# EAGLE design DC24-Darknet_Badge (EAGLE 7.3.0)
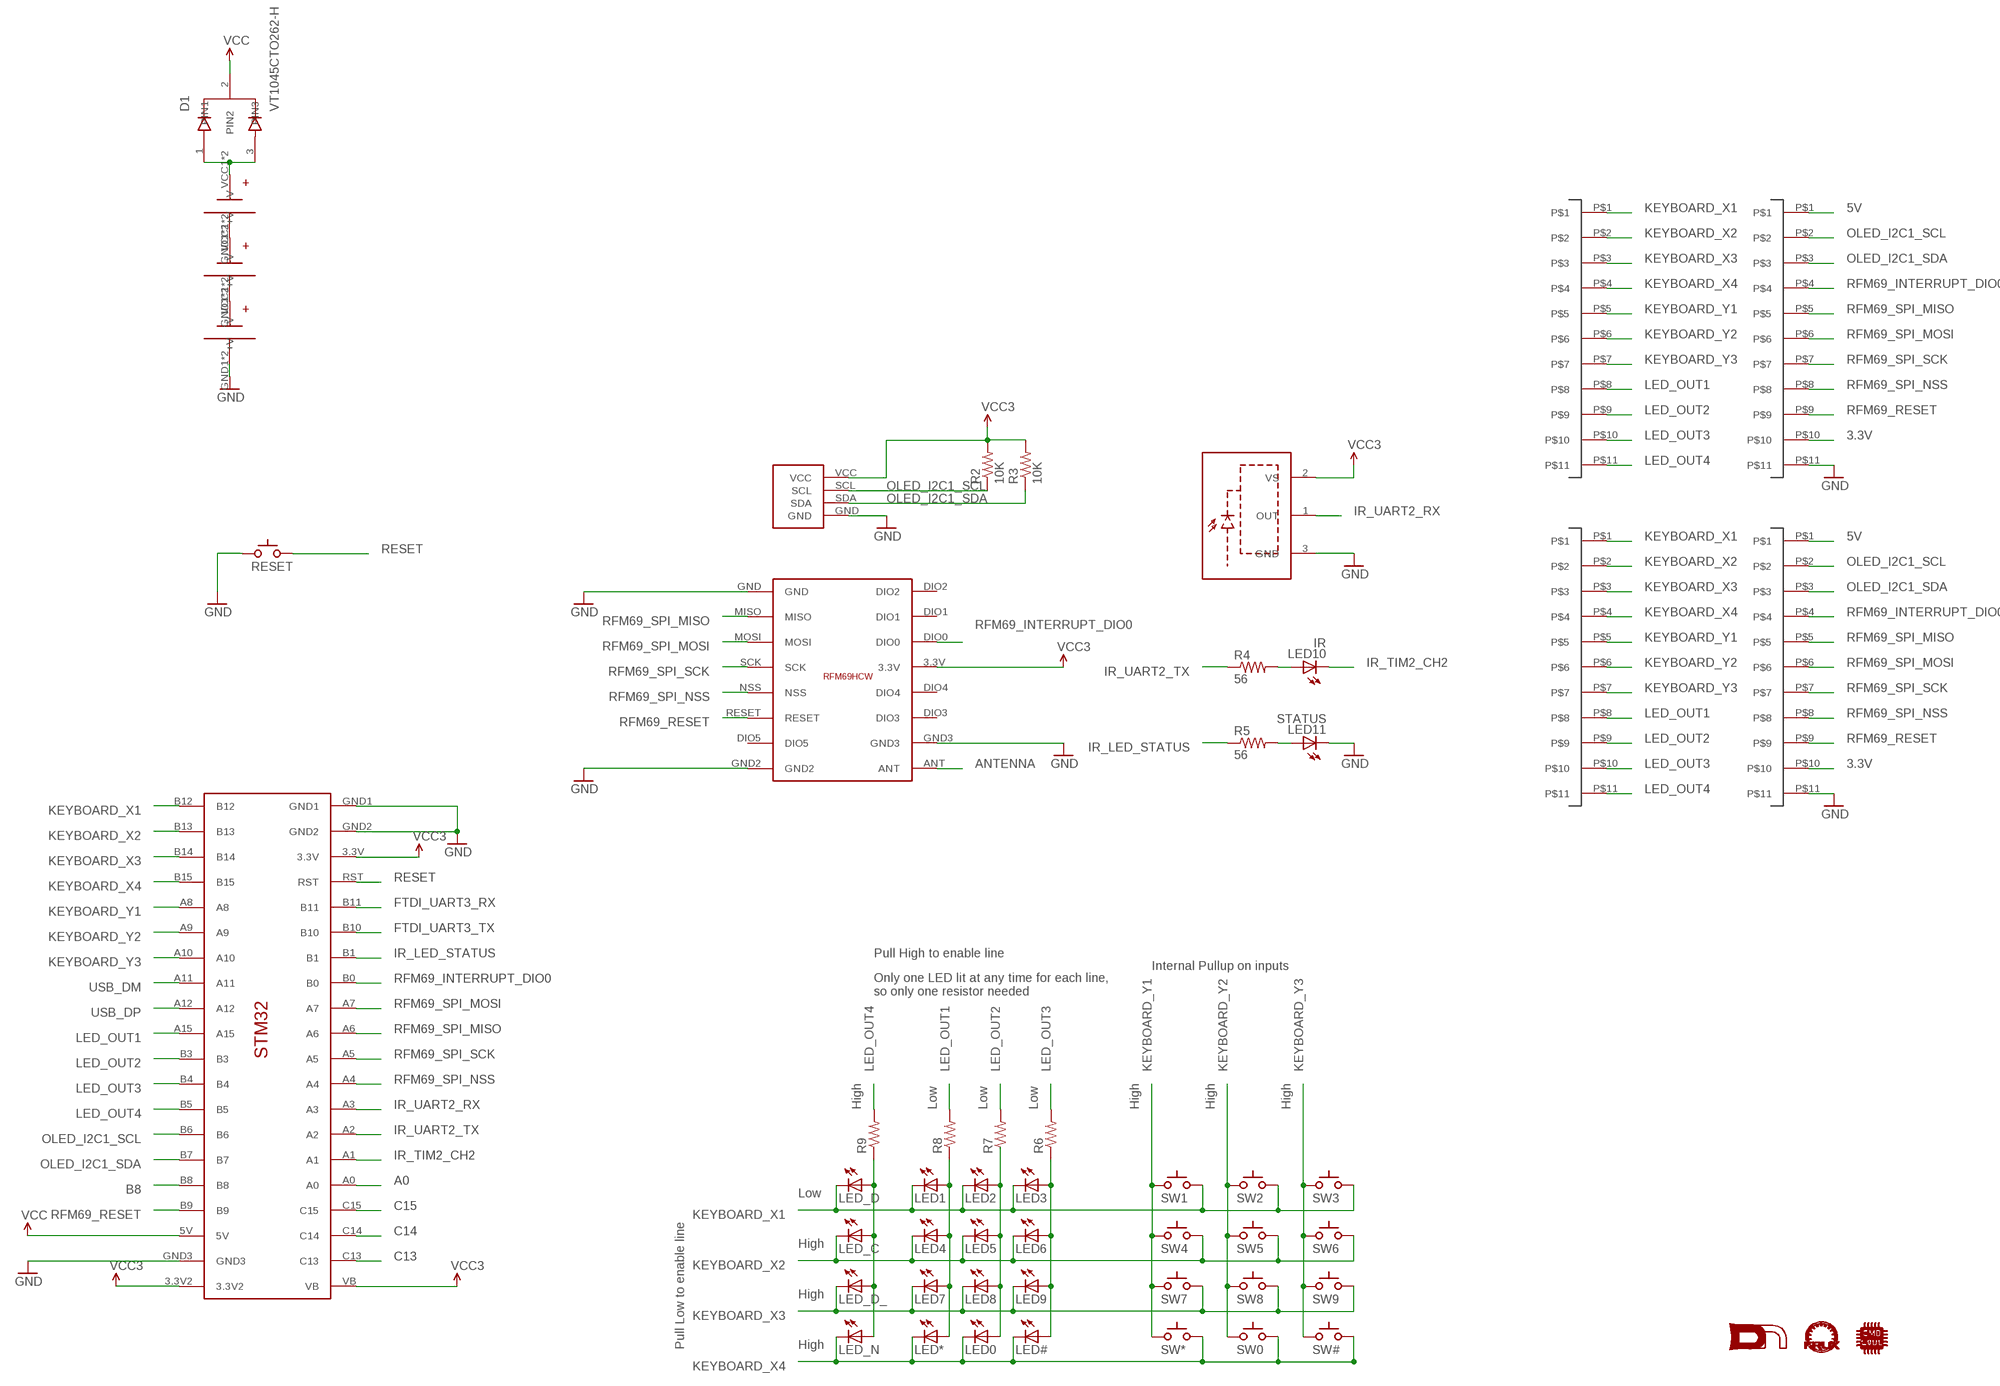
[diagram p0: schematic, sheet 1]

## Parts
D1  VT1045CTO262-H  [TO262-H]
LED0  LEDREVERSEMOUNT  [GULLWING_LED]
LED1  LEDREVERSEMOUNT  [GULLWING_LED]
LED2  LEDREVERSEMOUNT  [GULLWING_LED]
LED3  LEDREVERSEMOUNT  [GULLWING_LED]
LED4  LEDREVERSEMOUNT  [GULLWING_LED]
LED5  LEDREVERSEMOUNT  [GULLWING_LED]
LED6  LEDREVERSEMOUNT  [GULLWING_LED]
LED7  LEDREVERSEMOUNT  [GULLWING_LED]
LED8  LEDREVERSEMOUNT  [GULLWING_LED]
LED9  LEDREVERSEMOUNT  [GULLWING_LED]
LED10  IR  LEDLED5MM_EDGE  [LED5MM-EDGE]
LED11  STATUS  LEDLED5MM_EDGE  [LED5MM-EDGE]
LED#  LEDREVERSEMOUNT  [GULLWING_LED]
LED*  LEDREVERSEMOUNT  [GULLWING_LED]
LED_C  LEDREVERSEMOUNT  [GULLWING_LED]
LED_D  LEDREVERSEMOUNT  [GULLWING_LED]
LED_D_  LEDREVERSEMOUNT  [GULLWING_LED]
LED_N  LEDREVERSEMOUNT  [GULLWING_LED]
Q1  SOP22  [IR-MODULE]
R2  10K  RESISTORAXIAL-0.3  [AXIAL-0.3]
R3  10K  RESISTORAXIAL-0.3  [AXIAL-0.3]
R4  56  RESISTORAXIAL-0.3  [AXIAL-0.3]
R5  56  RESISTORAXIAL-0.3  [AXIAL-0.3]
R6  RESISTOR1206  [1206]
R7  RESISTOR1206  [1206]
R8  RESISTOR1206  [1206]
R9  RESISTOR1206  [1206]
RESET  SWITCH_TACTILETACTILE-2PIN-NARROW  [TACTILE-2PIN-NARROW]
SW0  SWITCH_TACTILETACTILE-2PIN-NARROW  [TACTILE-2PIN-NARROW]
SW1  SWITCH_TACTILETACTILE-2PIN-NARROW  [TACTILE-2PIN-NARROW]
SW2  SWITCH_TACTILETACTILE-2PIN-NARROW  [TACTILE-2PIN-NARROW]
SW3  SWITCH_TACTILETACTILE-2PIN-NARROW  [TACTILE-2PIN-NARROW]
SW4  SWITCH_TACTILETACTILE-2PIN-NARROW  [TACTILE-2PIN-NARROW]
SW5  SWITCH_TACTILETACTILE-2PIN-NARROW  [TACTILE-2PIN-NARROW]
SW6  SWITCH_TACTILETACTILE-2PIN-NARROW  [TACTILE-2PIN-NARROW]
SW7  SWITCH_TACTILETACTILE-2PIN-NARROW  [TACTILE-2PIN-NARROW]
SW8  SWITCH_TACTILETACTILE-2PIN-NARROW  [TACTILE-2PIN-NARROW]
SW9  SWITCH_TACTILETACTILE-2PIN-NARROW  [TACTILE-2PIN-NARROW]
SW#  SWITCH_TACTILETACTILE-2PIN-NARROW  [TACTILE-2PIN-NARROW]
SW*  SWITCH_TACTILETACTILE-2PIN-NARROW  [TACTILE-2PIN-NARROW]
U$1  I2C_0.96_OLEDOLED  [I2C_0.96_OLED]
U$2  RFM69HCWRFN69HCWSMD  [16PIN-PCB-SMD]
U$3  AAA_BATTERYAAA_BATTERY_CLIP  [AAA_BATTERY_CLIP]
U$4  AAA_BATTERYAAA_BATTERY_CLIP  [AAA_BATTERY_CLIP]
U$5  AAA_BATTERYAAA_BATTERY_CLIP  [AAA_BATTERY_CLIP]
U$6  HEADER_11PIN  [1X11]
U$13  HEADER_11PIN  [1X11]
U$14  HEADER_11PIN  [1X11]
U$15  STM32_DEV_BOARDSTM32_DEV_BOARD  [STM32_DEV_BOARD]
U$17  HEADER_11PIN  [1X11]
U$21  KRUX_LOGO  [KRUX_LOGO]
U$22  DN_LOGO  [DN_LOGO]
U$23  CMD_C0DE_LOGO  [CMD_C0DE_LOGO]

## Nets
3.3V: Q1.2(VS) R2.P$2 R3.P$2 U$1.VCC U$2.3.3V U$13.P$10 U$15.3.3V U$15.3.3V2 U$15.VB U$17.P$10 ; supply symbol labelled VCC3
5V: D1.2(PIN2) U$13.P$1 U$15.5V U$17.P$1 ; supply symbol labelled VCC
A0: U$15.A0
ANTENNA: U$2.ANT
B8: U$15.B8
C13: U$15.C13
C14: U$15.C14
C15: U$15.C15
FTDI_UART3_RX: U$15.B11
FTDI_UART3_TX: U$15.B10
GND: LED11.K(C) Q1.3(GND) RESET.P$2(C) U$1.GND U$2.GND U$2.GND2 U$2.GND3 U$5.GND1(-V) U$5.GND2(-V) U$13.P$11 U$15.GND1 U$15.GND2 U$15.GND3 U$17.P$11
IR_LED_STATUS: R5.P$1 U$15.B1
IR_TIM2_CH2: LED10.K(C) U$15.A1
IR_UART2_RX: Q1.1(OUT) U$15.A3
IR_UART2_TX: R4.P$1 U$15.A2
KEYBOARD_X1: LED1.C LED2.C LED3.C LED_D.C SW1.P$1(A) SW2.P$1(A) SW3.P$1(A) U$6.P$1 U$14.P$1 U$15.B12
KEYBOARD_X2: LED4.C LED5.C LED6.C LED_C.C SW4.P$1(A) SW5.P$1(A) SW6.P$1(A) U$6.P$2 U$14.P$2 U$15.B13
KEYBOARD_X3: LED7.C LED8.C LED9.C LED_D_.C SW7.P$1(A) SW8.P$1(A) SW9.P$1(A) U$6.P$3 U$14.P$3 U$15.B14
KEYBOARD_X4: LED0.C LED#.C LED*.C LED_N.C SW0.P$1(A) SW#.P$1(A) SW*.P$1(A) U$6.P$4 U$14.P$4 U$15.B15
KEYBOARD_Y1: SW1.P$2(C) SW4.P$2(C) SW7.P$2(C) SW*.P$2(C) U$6.P$5 U$14.P$5 U$15.A8
KEYBOARD_Y2: SW0.P$2(C) SW2.P$2(C) SW5.P$2(C) SW8.P$2(C) U$6.P$6 U$14.P$6 U$15.A9
KEYBOARD_Y3: SW3.P$2(C) SW6.P$2(C) SW9.P$2(C) SW#.P$2(C) U$6.P$7 U$14.P$7 U$15.A10
LED_OUT1: R8.2 U$6.P$8 U$14.P$8 U$15.A15
LED_OUT2: R7.2 U$6.P$9 U$14.P$9 U$15.B3
LED_OUT3: R6.2 U$6.P$10 U$14.P$10 U$15.B4
LED_OUT4: R9.2 U$6.P$11 U$14.P$11 U$15.B5
N$1: LED10.A R4.P$2
N$2: LED11.A R5.P$2
N$3: D1.1(PIN1) D1.3(PIN3) U$3.VCC1(+V) U$3.VCC2(+V)
N$8: LED3.A LED6.A LED9.A LED#.A R6.1
N$9: LED0.A LED2.A LED5.A LED8.A R7.1
N$10: LED1.A LED4.A LED7.A LED*.A R8.1
N$11: LED_C.A LED_D.A LED_D_.A LED_N.A R9.1
N$13: U$3.GND1(-V) U$3.GND2(-V) U$4.VCC1(+V) U$4.VCC2(+V)
N$14: U$4.GND1(-V) U$4.GND2(-V) U$5.VCC1(+V) U$5.VCC2(+V)
OLED_I2C1_SCL: R2.P$1 U$1.SCL U$13.P$2 U$15.B6 U$17.P$2
OLED_I2C1_SDA: R3.P$1 U$1.SDA U$13.P$3 U$15.B7 U$17.P$3
RESET: RESET.P$1(A) U$15.RST
RFM69_INTERRUPT_DIO0: U$2.DIO0 U$13.P$4 U$15.B0 U$17.P$4
RFM69_RESET: U$2.RESET U$13.P$9 U$15.B9 U$17.P$9
RFM69_SPI_MISO: U$2.MISO U$13.P$5 U$15.A6 U$17.P$5
RFM69_SPI_MOSI: U$2.MOSI U$13.P$6 U$15.A7 U$17.P$6
RFM69_SPI_NSS: U$2.NSS U$13.P$8 U$15.A4 U$17.P$8
RFM69_SPI_SCK: U$2.SCK U$13.P$7 U$15.A5 U$17.P$7
USB_DM: U$15.A11
USB_DP: U$15.A12
Unconnected: U$2.DIO1 U$2.DIO2 U$2.DIO3 U$2.DIO4 U$2.DIO5

## Notes on the sheet
- Pull High to enable line
- Internal Pullup on inputs
- Only one LED lit at any time for each line,
  so only one resistor needed
- High | Low | Low | Low | High | High | High
- Low
- High
- High
- Pull Low to enable line | High

## Library data of the parts
D1 = SYNShop:VT1045C
LED0 LED1-LED11 LED# LED* LED_C LED_D LED_D_ LED_N = SYNShop:LED: LEDs Standard schematic elements and footprints for 5mm, 3mm, 1206, and 0603 sized LEDs. 5mm - Spark Fun Electronics SKU : COM-00529 (and others)
Q1 = SYNShop:SOP22
R2-R9 = SYNShop:RESISTOR: Resistor Basic schematic elements and footprints for 0603, 1206, and PTH resistors.
RESET SW0 SW1-SW9 SW# SW* = SYNShop:SWITCH_TACTILE
U$1 = SYNShop:I2C_0.96_OLED
U$2 = SYNShop:RFM69HCW
U$3-U$5 = SYNShop:AAA_BATTERY
U$6 U$13 U$14 U$17 = SYNShop:HEADER_11PIN
U$15 = SYNShop:STM32_DEV_BOARD
U$21 = SYNShop:KRUX_LOGO
U$22 = SYNShop:DN_LOGO
U$23 = SYNShop:CMD_C0DE_LOGO

## Board
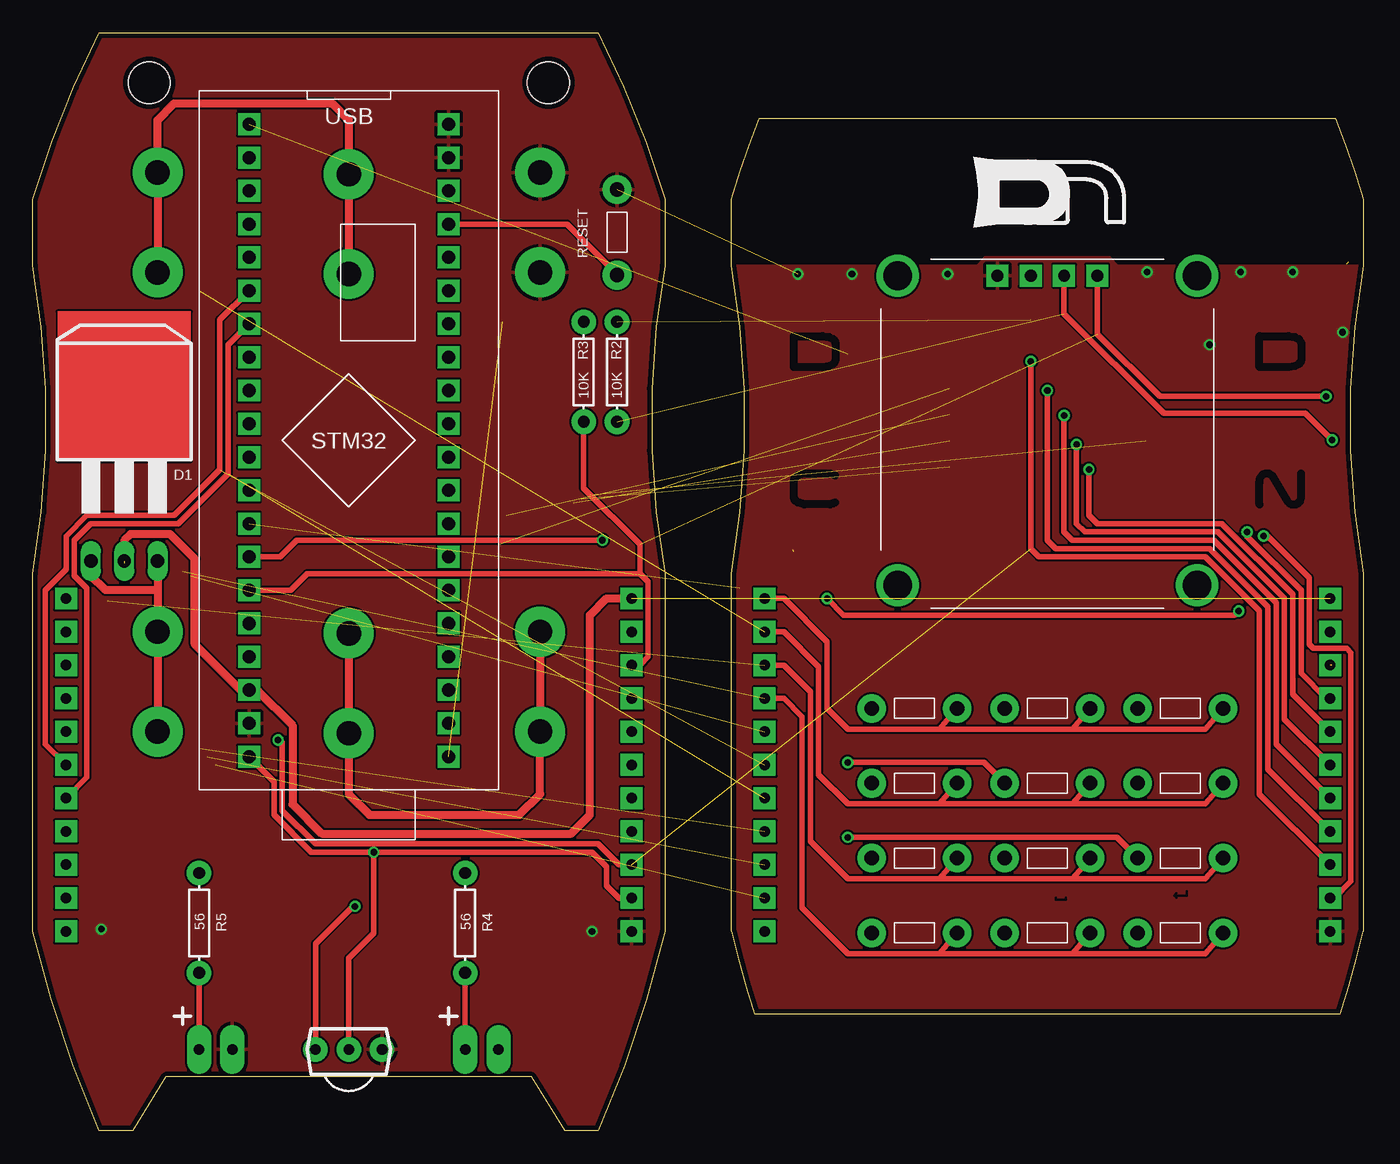
[diagram p1: board, top side]
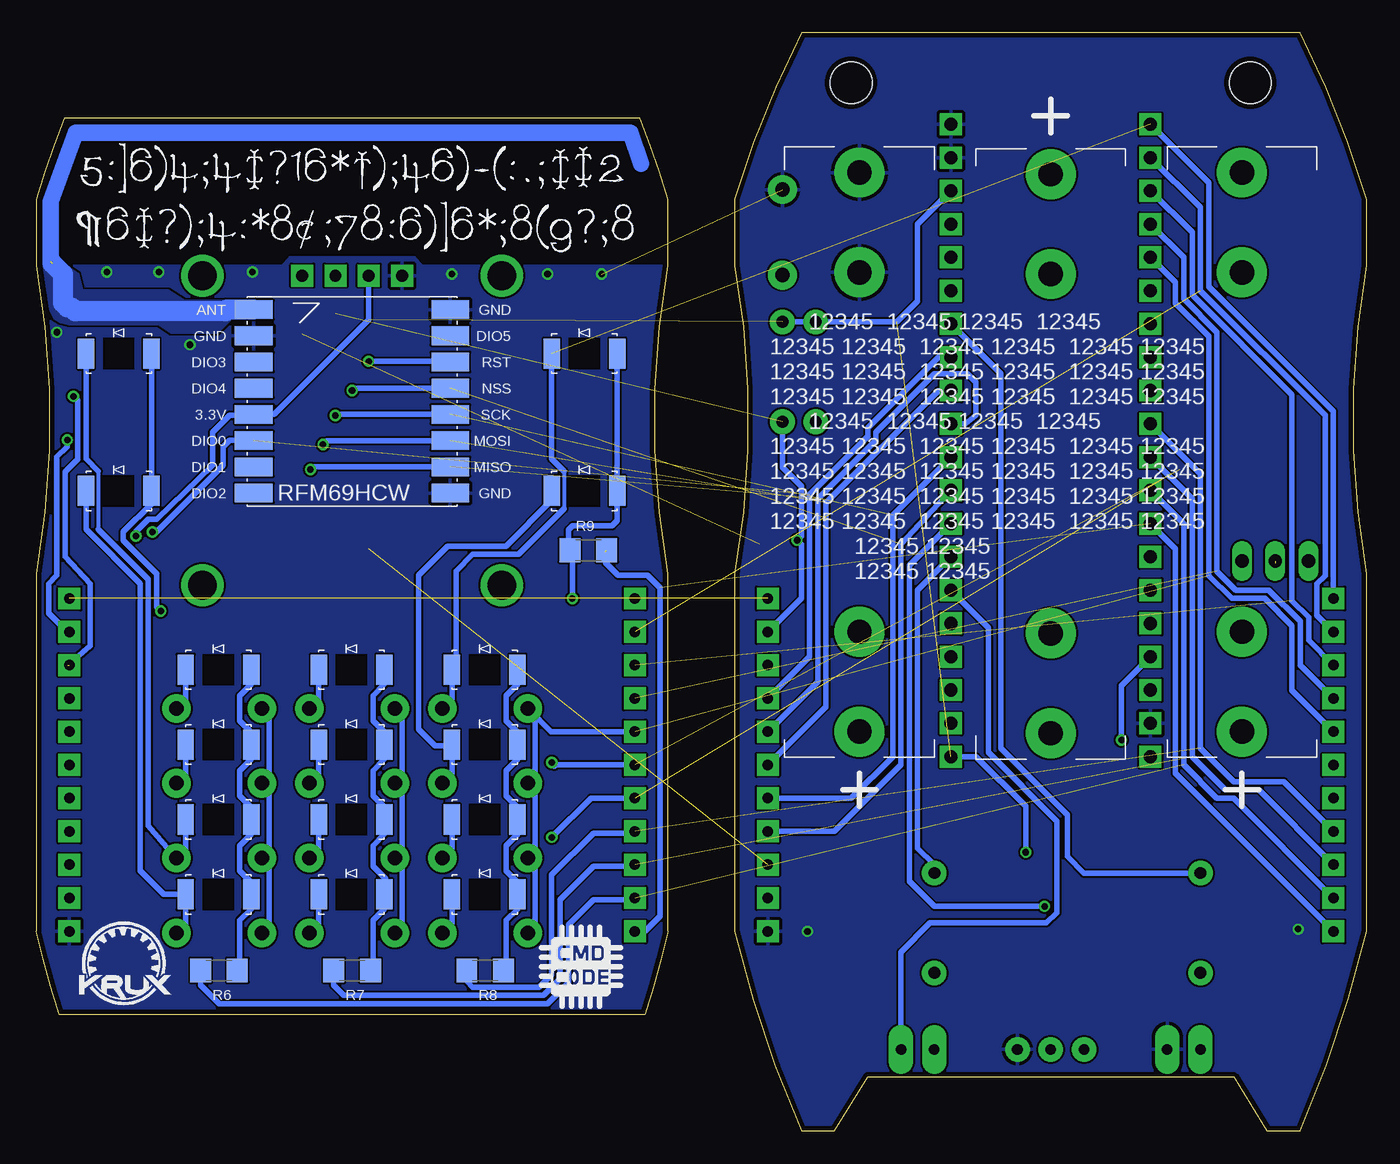
[diagram p2: board, bottom side, seen from below]

Size 101.6 x 83.82 mm. Coordinates in mm from the lower left corner, seen from the top.
Outline: 0,71.12 arc-10 5.08,83.82 43.18,83.82 arc-10 48.26,71.12 48.26,66.04 arc20 48.26,42.55 48.26,15.24 arc-10 43.18,0 40.64,0 38.1,4.13 10.16,4.13 7.62,0 5.08,0 arc-10 0,15.24 0,42.55 arc20 0,66.04 0,71.12
Outline: 55.5,77.31 99.44,77.31 arc-5 101.6,71.12 101.6,66.04 arc20 101.6,42.55 101.6,15.24 arc-4 99.84,8.91 55.11,8.89 arc-4 53.34,15.24 53.34,42.55 arc20 53.34,66.04 53.34,71.12 arc-5 55.5,77.31
Copper layers (1*16): Top 0.0356mm / dielectric 1.5011mm / Bottom 0.0356mm
Design rules "LaenPCBOrder": minimum track width 6mil, minimum drill 13mil, track to track 6mil, track to pad 6mil, pad to pad 6mil, via to via 6mil, smd to smd 6mil, copper to edge 15mil, drill to drill 6mil, minimum pad ring 7mil, minimum via ring 7mil, stop-mask expansion 4mil, vias tented up to drill 0mil, thermal gap 10mil
Holes 3.2 mm at 8.89,80.01 39.37,80.01
tRestrict: 55 lines

### Footprints (pad centres in the part's own frame; a part is rotated, then mirrored left to right if it is on the bottom)
TO262-H = drill 1.016 long: 1 -2.54,-12.7; 2 0,-12.7; 3 2.54,-12.7
GULLWING_LED = smd 1.245 x 2.3: A 5,-1.5; C 0,-1.5
LED5MM-EDGE = drill 0.813 pad 1.88 long: A -1.27,0; K 1.27,0
IR-MODULE = drill 0.813 pad 1.88: 1 -2.54,0; 2 0,0; 3 2.54,0
AXIAL-0.3 = drill 0.9 pad 1.88: P$1 -3.81,0; P$2 3.81,0
1206 = smd 1.6 x 1.8: 1 -1.4,0; 2 1.4,0
TACTILE-2PIN-NARROW = drill 1.1 pad 2.184: P$1 3.264,0; P$2 -3.264,0
I2C_0.96_OLED = drill 0.9 pad 1.676 square: GND -3.81,0; SCL 1.27,0; SDA 3.81,0; VCC -1.27,0 | drill 2.2: P$5 11.43,0; P$6 -11.43,0; P$7 11.43,-23.622; P$8 -11.43,-23.622
16PIN-PCB-SMD = smd 2.9 x 1.422: 3.3V 7.5,1; ANT 7.5,-7; DIO0 7.5,3; DIO1 7.5,5; DIO2 7.5,7; DIO3 7.5,-3; DIO4 7.5,-1; DIO5 -7.5,-5; GND -7.5,7; GND2 -7.5,-7; GND3 7.5,-5; MISO -7.5,5; MOSI -7.5,3; NSS -7.5,-1; RESET -7.5,-3; SCK -7.5,1
AAA_BATTERY_CLIP = drill 1.854 pad 3.81: GND1 35.052,0; GND2 42.672,0; VCC1 0,0; VCC2 7.62,0
1X11 = drill 0.8 pad 1.676 square: P$1 0,0; P$2 0,-2.54; P$3 0,-5.08; P$4 0,-7.62; P$5 0,-10.16; P$6 0,-12.7; P$7 0,-15.24; P$8 0,-17.78; P$9 0,-20.32; P$10 0,-22.86; P$11 0,-25.4
STM32_DEV_BOARD = drill 1 pad 1.676 square: 3.3V 15.24,-5.08; 3.3V2 0,-48.26; 5V 0,-43.18; A0 15.24,-38.1; A1 15.24,-35.56; A2 15.24,-33.02; A3 15.24,-30.48; A4 15.24,-27.94; A5 15.24,-25.4; A6 15.24,-22.86; A7 15.24,-20.32; A8 0,-10.16; A9 0,-12.7; A10 0,-15.24; A11 0,-17.78; A12 0,-20.32; A15 0,-22.86; B0 15.24,-17.78; B1 15.24,-15.24; B3 0,-25.4; B4 0,-27.94; B5 0,-30.48; B6 0,-33.02; B7 0,-35.56; B8 0,-38.1; B9 0,-40.64; B10 15.24,-12.7; B11 15.24,-10.16; B12 0,0; B13 0,-2.54; B14 0,-5.08; B15 0,-7.62; C13 15.24,-45.72; C14 15.24,-43.18; C15 15.24,-40.64; GND1 15.24,0; GND2 15.24,-2.54; GND3 0,-45.72; RST 15.24,-7.62; VB 15.24,-48.26

### Placement (x,y rotation side)
D1  6.99,56.2 0 top
LED0  80.01,19.56 0 bottom
LED1  69.85,36.7 0 bottom
LED2  80.01,36.7 0 bottom
LED3  90.17,36.7 0 bottom
LED4  69.85,30.99 0 bottom
LED5  80.01,30.99 0 bottom
LED6  90.17,30.99 0 bottom
LED7  69.85,25.27 0 bottom
LED8  80.01,25.27 0 bottom
LED9  90.17,25.27 0 bottom
LED10  34.29,6.22 0 top
LED11  13.97,6.22 0 top
LED#  90.17,19.56 0 bottom
LED*  69.85,19.56 0 bottom
LED_C  62.23,50.36 0 bottom
LED_D  62.23,60.83 0 bottom
LED_D_  97.79,60.83 0 bottom
LED_N  97.79,50.36 0 bottom
Q1  24.13,6.22 0 top
R2  44.61,57.94 90 top
R3  42.07,57.94 90 top
R4  33.02,15.87 270 top
R5  12.7,15.87 270 top
R6  87.63,12.26 180 bottom
R7  77.47,12.26 180 bottom
R8  67.31,12.26 180 bottom
R9  59.44,44.32 0 bottom
RESET  44.61,68.58 270 top
SW0  77.47,15.11 0 top
SW1  67.31,32.26 0 top
SW2  77.47,32.26 0 top
SW3  87.63,32.26 0 top
SW4  67.31,26.54 0 top
SW5  77.47,26.54 0 top
SW6  87.63,26.54 0 top
SW7  67.31,20.83 0 top
SW8  77.47,20.83 0 top
SW9  87.63,20.83 0 top
SW#  87.63,15.11 0 top
SW*  67.31,15.11 0 top
U$1  77.47,65.28 0 top
U$2  77.47,55.69 180 bottom
U$3  9.52,30.48 90 bottom
U$4  24.13,73.03 270 bottom
U$5  38.73,30.48 90 bottom
U$6  55.88,40.64 0 top
U$13  99.06,40.64 0 top
U$14  2.54,40.64 0 top
U$15  16.51,76.84 0 top
U$17  45.72,40.64 0 top
U$21  94.93,12.86 0 bottom
U$22  71.44,69.06 0 top
U$23  60.01,12.86 0 bottom

### Tracks (layer width: path | path; a pad name or v marks a point on that pad's centre or on a via)
3.3V  (via drill 0.5)  (2 unrouted)
  Top 0.406: U$15.3.3V2 18.41,26.67 18.41,24.13 21.27,21.27 v26.04,21.27 | v26.04,21.27 42.7,21.27 43.81,20.16 43.81,18.73 44.77,17.78 U$17.P$10 | U$13.P$10 99.38,17.78 100.65,19.05 100.65,36.51 100.33,36.83 97.79,36.83 97.47,37.15 97.47,42.23 94.3,45.4 v93.98,45.4 | Q1.2 24.13,13.18 26.04,15.08 v26.04,21.27
  Bottom 0.406: U$15.VB 29.84,28.58 26.04,24.77 v26.04,21.27 | U$15.3.3V 34.29,69.22 34.29,63.34 35.88,61.75 R3.P$2 R2.P$2 | v93.98,45.4 93.98,45.72 93.03,46.67 92.39,46.67 88.11,50.8 88.11,53.34 86.84,54.61 85.05,54.61 U$2.3.3V 83.42,54.69 76.2,61.91 U$1.VCC
5V  (2 unrouted)
  Top 0.61: U$17.P$1 43.81,40.64 42.55,39.37 42.55,24.13 41.12,22.7 22.07,22.7 19.84,24.92 19.84,30.96 17.14,33.66 U$15.5V 15.88,33.66 12.38,37.15 12.38,43.66 10.48,45.56 7.46,45.56 6.99,45.09 6.99,43.34
ANTENNA  (1 unrouted)
  Bottom 1.27: 100.49,66.36 100.49,70.96 98.58,76.2 56.2,76.2 55.4,73.82
  Bottom 1.524: U$2.ANT 87.01,62.69 87.15,62.55 98.58,62.55 98.9,62.86 99.22,62.86 99.54,63.18 99.54,65.41 100.33,66.2
  pour Bottom: 86.68,63.34 90.33,63.34 91.6,64.14 98.11,64.14 98.42,65.41 99.38,66.04 100.96,66.04 100.49,62.71 100.17,62.07 99.69,61.75 99.06,61.59 92.23,61.59 91.28,60.96 87.79,60.96 86.68,62.07
GND  (via drill 0.5)  (1 unrouted)
  other vias: 92.23,65.56 96.2,65.56 69.85,65.41 58.42,65.41 89.85,60.01 62.55,65.41 85.09,65.56 42.7,15.24 5.24,15.4 100.01,60.96
  pour Top: 53.66,42.55 53.66,15.24 55.24,9.21 99.69,9.21 101.28,15.24 101.28,42.55 100.33,50.8 100.33,58.1 101.28,66.04 90.49,66.04 89.53,66.99 88.27,66.99 87.31,66.04 82.87,66.04 82.23,66.67 72.71,66.67 72.07,66.04 67.63,66.04 66.67,66.99 65.4,66.99 64.45,66.04 53.66,66.04 54.61,57.47 54.61,51.44
  pour Bottom (rank 2): 72.07,66.04 53.66,66.04 54.29,59.06 54.29,53.34 53.98,47.62 53.34,42.55 53.34,15.24 55.24,8.89 99.69,8.89 101.6,15.24 101.6,42.55 100.65,49.21 100.65,57.47 101.6,66.04 82.87,66.04 82.23,66.67 72.71,66.67
  pour Top: 0.32,42.55 0.32,15.24 1.91,9.21 5.08,0.32 7.62,0.32 10.16,4.45 38.1,4.45 40.64,0.32 43.18,0.32 46.36,9.21 47.94,15.24 47.94,42.55 46.99,50.8 46.99,58.1 47.94,66.04 47.94,71.12 45.72,77.79 43.18,83.5 5.4,83.5 2.54,77.79 0.32,71.12 0.32,66.04 1.27,57.47 1.27,51.44
  pour Bottom: 2.54,77.47 0.32,71.12 0.32,66.36 0.95,59.37 0.95,53.66 0.63,47.94 0,42.86 0,15.56 2.22,8.26 5.08,0.32 7.62,0.32 10.16,4.45 38.1,4.45 40.64,0.32 43.18,0.32 46.36,9.21 48.26,15.56 48.26,42.86 47.31,49.53 47.31,57.79 48.26,66.36 47.94,71.12 45.72,77.79 43.18,83.5 5.08,83.5
IR_LED_STATUS
  Bottom 0.406: R5.P$1 21.59,19.69 22.86,20.95 22.86,24.13 27.94,29.21 27.94,57.79 U$15.B1
IR_TIM2_CH2
  Bottom 0.406: U$15.A1 28.89,38.42 28.89,28.89 23.65,23.65 23.65,16.67 24.45,15.87 33.34,15.87 35.56,13.65 LED10.K
IR_UART2_RX  (via drill 0.5)
  Top 0.406: v24.61,17.15 24.45,17.15 21.59,14.29 Q1.1
  Bottom 0.406: U$15.A3 34.93,43.18 34.93,19.05 33.02,17.15 v24.61,17.15
IR_UART2_TX
  Bottom 0.406: R4.P$1 33.02,20.32 34.29,21.59 34.29,41.27 U$15.A2
KEYBOARD_X1  (1 unrouted)
  Top 0.406: SW1.P$1 69.21,30.67 | 69.21,30.67 62.23,30.67 60.64,32.26 60.64,37.34 57.34,40.64 U$6.P$1 | SW2.P$1 79.38,30.67 | 79.38,30.67 69.21,30.67 | SW3.P$1 89.53,30.67 79.38,30.67
  Bottom 0.305: 61.28,50.36 61.28,47.5
  Bottom 0.406: SW1.P$1 69.85,32.98 LED1.C 69.53,35.88 69.53,42.74 68.26,44.01 64.77,44.01 61.28,47.5 | LED2.C 80.01,32.98 SW2.P$1 | LED3.C 90.17,32.98 SW3.P$1 | LED_D.C 62.23,51.31 61.28,50.36 | U$15.B12 12.07,72.39 12.07,64.45 2.54,54.93 U$14.P$1
KEYBOARD_X2  (1 unrouted)
  Top 0.406: SW6.P$1 89.53,24.95 79.38,24.95 | 79.38,24.95 69.21,24.95 | 69.21,24.95 62.23,24.95 60.01,27.18 60.01,35.43 57.34,38.1 U$6.P$2 | SW5.P$1 79.38,24.95 | SW4.P$1 69.21,24.95
  Bottom 0.406: SW4.P$1 69.85,27.27 LED4.C 69.94,29.4 71.12,29.4 72.39,30.67 72.39,42.42 70.17,44.64 65.72,44.64 62.23,48.13 LED_C.C | LED5.C 80.01,27.27 SW5.P$1 | LED6.C 90.17,27.27 SW6.P$1 | U$15.B13 12.7,70.48 12.7,64.14 3.17,54.61 3.17,42.39 3.81,41.75 3.81,39.37 U$14.P$2
KEYBOARD_X3  (1 unrouted)
  Top 0.406: SW9.P$1 89.53,19.24 79.38,19.24 | 79.38,19.24 69.21,19.24 | 69.21,19.24 62.23,19.24 59.37,22.1 59.37,33.53 57.34,35.56 U$6.P$3 | SW8.P$1 79.38,19.24 | SW7.P$1 69.21,19.24
  Bottom 0.305: 96.84,50.36 96.84,45.91
  Bottom 0.406: LED7.C 69.85,21.55 SW7.P$1 | LED8.C 80.01,21.55 SW8.P$1 | LED9.C 90.17,21.55 SW9.P$1 93.03,23.28 93.03,42.1 96.84,45.91 | LED_D_.C 97.79,51.31 96.84,50.36 | U$15.B14 13.34,68.58 13.34,63.82 5.72,56.2 5.72,40.48 4.45,39.21 4.45,37.47 U$14.P$3
KEYBOARD_X4  (1 unrouted)
  Top 0.406: SW#.P$1 89.53,13.53 79.38,13.53 | 79.38,13.53 69.21,13.53 | 69.21,13.53 62.23,13.53 58.74,17.02 58.74,31.62 57.34,33.02 U$6.P$4 | SW0.P$1 79.38,13.53 | SW*.P$1 69.21,13.53
  Bottom 0.406: LED*.C 69.85,15.84 SW*.P$1 | LED0.C 80.01,15.84 SW0.P$1 | SW#.P$1 90.17,15.84 LED#.C 91.84,18.06 93.66,19.88 93.66,41.78 97.79,45.91 LED_N.C | U$15.B15 13.97,66.67 13.97,63.5 11.43,60.96 11.43,42.7 10,41.27 7.46,41.27 5.08,38.89 5.08,35.56 U$14.P$4
KEYBOARD_Y1  (1 unrouted)
  Bottom 0.406: SW*.P$2 63.5,15.56 63.5,20.32 SW7.P$2 63.5,21.59 63.5,26.03 SW4.P$2 63.5,27.3 63.5,31.75 SW1.P$2 62.27,30.48 U$6.P$5 | U$15.A8 14.61,64.77 14.61,63.18 12.07,60.64 12.07,42.39 10.32,40.64 7.78,40.64 5.72,38.58 5.72,33.66 U$14.P$5
KEYBOARD_Y2  (via drill 0.5)  (1 unrouted)
  Top 0.406: v62.23,28.13 72.62,28.13 SW5.P$2 | U$15.A9 14.29,61.91 14.29,50.48 10.8,46.99 4.13,46.99 2.54,45.4 2.54,42.86 0.95,41.27 0.95,29.53 U$14.P$6
  Bottom 0.406: SW2.P$2 73.66,31.43 73.66,27.3 SW5.P$2 73.66,25.72 73.66,21.59 SW8.P$2 73.66,20 73.66,15.87 SW0.P$2 | U$6.P$6 62.04,27.94
  Bottom 0.61: 62.04,27.94 v62.23,28.13
KEYBOARD_Y3  (via drill 0.5)  (1 unrouted)
  Top 0.406: v62.23,22.41 82.78,22.41 SW9.P$2 | U$15.A10 14.92,60.01 14.92,50.16 11.11,46.36 4.45,46.36 3.17,45.09 3.17,42.39 4.13,41.43 4.13,26.99 U$14.P$7
  Bottom 0.406: SW#.P$2 83.82,15.56 83.82,20 SW9.P$2 83.82,21.59 83.82,25.72 SW6.P$2 83.82,27.3 83.82,31.43 SW3.P$2 | U$6.P$7 59.24,25.4 v62.23,22.41
LED_OUT1  (1 unrouted)
  Bottom 0.406: R8.2 68.71,11.43 68.26,10.99 63.18,10.99 62.23,11.94 62.23,19.56 59.05,22.73 56.01,22.73 U$6.P$8 | U$15.A15 12.7,50.16 12.7,29.21 10.16,26.67 6.35,26.67 U$14.P$8
LED_OUT2  (1 unrouted)
  Bottom 0.406: R7.2 78.87,11.12 78.1,10.35 62.87,10.35 61.6,11.62 61.6,17.65 59.05,20.19 56.01,20.19 U$6.P$9 | U$15.B3 13.34,48.26 13.34,28.58 10.8,26.03 8.25,26.03 U$14.P$9
LED_OUT3  (1 unrouted)
  Bottom 0.406: R6.2 89.03,11.12 87.63,9.72 62.55,9.72 60.96,11.3 60.96,15.75 59.05,17.65 56.01,17.65 U$6.P$10 | U$15.B4 13.97,46.36 13.97,27.94 11.43,25.4 10.16,25.4 U$14.P$10
LED_OUT4  (2 unrouted)
  Bottom 0.406: U$6.P$11 55.12,15.24 53.98,16.38 53.98,41.47 54.93,42.42 57.15,42.42 58.1,43.37 58.1,44.19 | U$15.B5 14.61,44.45 14.61,27.3 U$14.P$11
N$1
  Top 0.406: R4.P$2 LED10.A
N$2
  Top 0.406: R5.P$2 LED11.A
N$3
  Top 0.61: 9.52,41.27 U$3.VCC2 U$3.VCC1 | D1.3 9.52,41.27 | 9.52,41.27 5.56,41.27 4.45,42.39 D1.1
N$8
  Bottom 0.406: LED3.A 85.17,34.08 86.04,33.21 86.04,31.31 85.09,30.35 85.09,29.57 LED6.A 85.17,28.37 86.04,27.5 86.04,25.59 85.09,24.64 85.09,23.85 LED9.A 85.17,22.65 86.04,21.78 86.04,19.88 85.09,18.92 85.09,18.14 LED#.A 85.17,16.94 86.04,16.06 86.04,12.89 86.09,12.89 R6.1
N$9
  Bottom 0.406: LED2.A 75.01,34.08 75.88,33.21 75.88,31.31 74.93,30.35 74.93,29.57 LED5.A 75.01,28.37 75.88,27.5 75.88,25.59 74.93,24.64 74.93,23.85 LED8.A 75.01,22.65 75.88,21.78 75.88,20.19 74.93,19.24 74.93,18.14 LED0.A 75.01,16.94 75.88,16.06 75.88,12.89 75.93,12.89 R7.1
N$10
  Bottom 0.406: LED1.A 64.85,34.08 65.72,33.21 65.72,31.31 64.77,30.35 64.77,29.57 LED4.A 64.85,28.37 65.72,27.5 65.72,25.59 64.77,24.64 64.77,23.85 LED7.A 64.85,22.65 65.72,21.78 65.72,19.88 64.77,18.92 64.77,18.14 LED*.A 64.85,16.94 65.72,16.06 65.72,12.89 65.77,12.89 R8.1
N$11  (via drill 0.5)
  Top 0.406: v92.07,39.69 91.76,39.37 61.91,39.37 v60.64,40.64
  Bottom 0.406: LED_D_.A LED_N.A 92.79,47.86 94.93,45.72 94.93,45.09 92.39,42.55 92.39,40.01 v92.07,39.69 | 57.47,59.57 LED_D.A LED_C.A 57.23,46.59 57.63,46.2 60.64,46.2 60.96,45.88 60.96,44.45 R9.1 60.64,44.13 v60.64,40.64
N$12
  pour Top: 84.45,36.07 84.45,34.16 90.8,34.16 90.8,36.07
  pour Top: 84.45,30.35 84.45,28.45 90.8,28.45 90.8,30.35
  pour Top: 74.29,36.07 74.29,34.16 80.64,34.16 80.64,36.07
  pour Top: 84.45,24.64 84.45,22.73 90.8,22.73 90.8,24.64
  pour Top: 84.45,18.92 84.45,17.02 90.8,17.02 90.8,18.92
  pour Top: 74.29,18.92 74.29,17.02 80.64,17.02 80.64,18.92
  pour Top: 74.29,24.64 74.29,22.73 80.64,22.73 80.64,24.64
  pour Top: 74.29,30.35 74.29,28.45 80.64,28.45 80.64,30.35
  pour Top: 74.29,36.07 74.29,34.16 80.64,34.16 80.64,36.07
  pour Top: 64.13,36.07 64.13,34.16 70.48,34.16 70.48,36.07
  pour Top: 64.13,30.35 64.13,28.45 70.48,28.45 70.48,30.35
  pour Top: 64.13,24.64 64.13,22.73 70.48,22.73 70.48,24.64
  pour Top: 64.13,18.92 64.13,17.02 70.48,17.02 70.48,18.92
N$13
  Top 0.61: U$3.GND1 U$3.GND2 9.52,77.15 10.8,78.42 22.86,78.42 24.13,77.15 U$4.VCC1 U$4.VCC2
N$14
  Top 0.61: U$4.GND1 U$4.GND2 24.13,25.72 25.72,24.13 37.15,24.13 38.73,25.72 U$5.VCC1 U$5.VCC2
OLED_I2C1_SCL  (via drill 0.5)  (1 unrouted)
  Top 0.406: v99.22,52.74 97.15,54.77 86.36,54.77 78.74,62.39 U$1.SCL | v43.5,45.09 20.16,45.09 18.89,43.82 U$15.B6
  Bottom 0.406: v99.22,52.74 99.22,52.23 100.01,51.47 100.01,42.42 100.65,41.78 100.65,39.53 99.22,38.1 U$13.P$2 | U$17.P$2 43.18,40.64 43.18,44.77 v43.5,45.09 43.18,45.4 43.18,49.21 44.61,50.64 R2.P$1
OLED_I2C1_SDA  (via drill 0.5)  (2 unrouted)
  Top 0.406: v98.74,56.07 86.04,56.07 81.28,60.8 U$1.SDA | U$17.P$3 46.36,35.56 46.99,36.2 46.99,41.91 46.36,42.55 | 46.36,42.55 20.96,42.55 19.69,41.27 U$15.B7 | R3.P$1 42.07,49.05 46.36,44.77 46.36,42.55
  Bottom 0.406: 99.19,35.56 97.47,37.02 97.47,41.75 99.38,43.82 99.38,50.32 98.42,51.28 98.42,55.75 v98.74,56.07 | 81.28,65.09 U$1.SDA
RESET
  Top 0.406: RESET.P$1 44.61,65.41 40.8,69.22 U$15.RST
RFM69_INTERRUPT_DIO0  (via drill 0.5)  (1 unrouted)
  Top 0.406: U$13.P$4 98.74,33.02 96.84,34.93 96.84,41.27 92.71,45.4 v92.71,45.72
  Bottom 0.406: U$15.B0 32.7,59.06 38.1,53.66 38.1,53.02 42.55,48.58 42.55,36.2 U$17.P$4 | v92.71,45.72 92.39,45.72 87.31,50.8 87.31,52.23 86.84,52.7 84.98,52.7 U$2.DIO0
RFM69_RESET  (via drill 0.5)  (1 unrouted)
  Top 0.406: U$13.P$9 93.66,25.72 93.66,39.69 89.53,43.82 76.83,43.82 76.2,44.45 v76.2,58.74 | U$17.P$9 44.77,20.32 43.18,21.91 21.59,21.91 19.05,24.45 19.05,29.69 v18.73,29.84
  Bottom 0.406: v18.73,29.84 18.73,33.97 U$15.B9 | v76.2,58.74 70.02,58.74 U$2.RESET
RFM69_SPI_MISO  (via drill 0.5)  (1 unrouted)
  Top 0.406: U$13.P$5 96.2,33.34 96.2,40.96 90.8,46.36 81.28,46.36 80.64,46.99 v80.64,50.48
  Bottom 0.406: U$17.P$5 41.91,34.29 41.91,48.26 37.47,52.7 37.47,53.34 33.02,57.79 30.48,57.79 29.84,57.15 29.84,54.61 30.64,53.98 U$15.A6 | U$2.MISO 80.44,50.69 v80.64,50.48
RFM69_SPI_MOSI  (via drill 0.5)  (1 unrouted)
  Top 0.406: U$13.P$6 95.57,31.43 95.57,40.64 90.49,45.72 80.33,45.72 79.69,46.36 v79.69,52.39
  Bottom 0.406: U$17.P$6 41.27,32.39 41.27,47.94 32.7,56.52 U$15.A7 | U$2.MOSI 79.39,52.69 v79.69,52.39
RFM69_SPI_NSS  (via drill 0.5)  (1 unrouted)
  Top 0.406: U$13.P$8 94.3,27.62 94.3,40.01 89.85,44.45 78.1,44.45 77.47,45.09 v77.47,56.52
  Bottom 0.406: U$15.A4 35.56,44.77 35.56,27.94 40.64,22.86 U$17.P$8 | U$2.NSS 77.29,56.69 v77.47,56.52
RFM69_SPI_SCK  (via drill 0.5)  (1 unrouted)
  Top 0.406: U$13.P$7 94.93,29.53 94.93,40.32 90.17,45.09 79.38,45.09 78.74,45.72 v78.74,54.61
  Bottom 0.406: U$15.A5 36.2,46.99 36.2,28.58 39.37,25.4 U$17.P$7 | U$2.SCK 78.34,54.69 v78.74,54.61

### Text on the board
tStop: 1 | ., | ? | 2 ABC | 3 DEF | 4 GHI | 5 JKL | 6 MNO | 7PQRS | 8 TUV | 9WXYZ | *#+ | 0
tRestrict: 1 | ., | ? | 2 ABC | 3 DEF | 4 GHI | 5 JKL | 6 MNO | 7PQRS | 8 TUV | 9WXYZ | *#+ | 0
_bsilk: 12345 12345 12345 12345 / 12345 12345 12345 12345 12345 12345 / 12345 12345 12345 12345 12345 12345 / 12345 12345 12345 12345 12345 12345 / 12345 12345 12345 12345 / 12345 12345 12345 12345 12345 12345 / 12345 12345 12345 12345 12345 12345 / 12345 12345 12345 12345 12345 12345 / 12345 12345 12345 12345 12345 12345 / 12345 12345 / 12345 12345